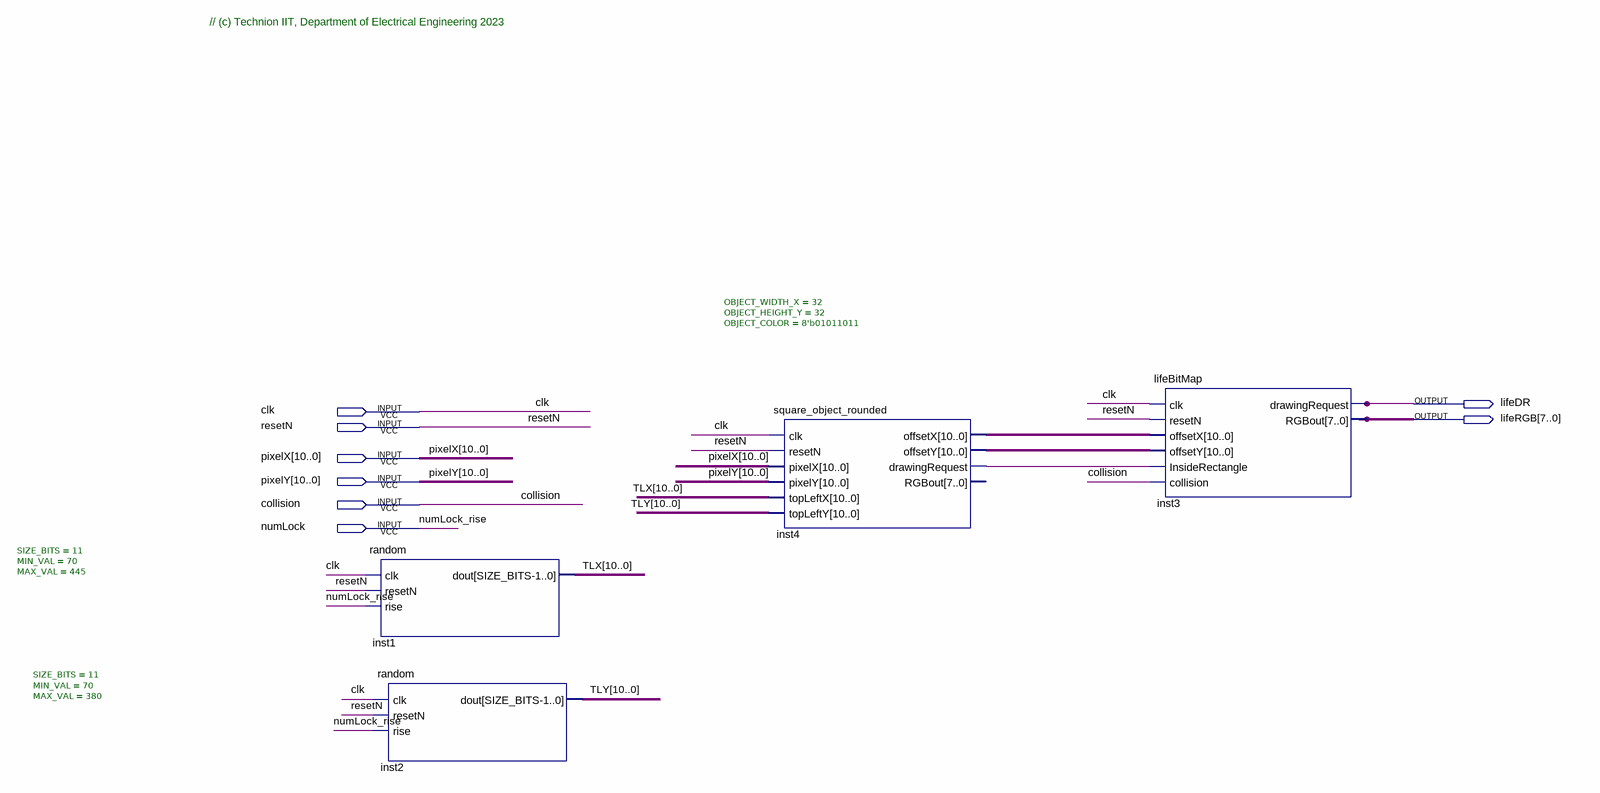
[diagram p0: schematic sheet]
// Quartus schematic Life_Block_T.bdf as structural Verilog: 4 symbols, 8 pins
module Life_Block_T (
  input  clk,
  input  resetN,
  input  [10:0] pixelX,
  input  [10:0] pixelY,
  input  collision,
  input  numLock,
  output lifeDR,
  output [7:0] lifeRGB
);

  wire inst4_drawingrequest;
  wire [10:0] inst4_offsetx, inst4_offsety, TLX, TLY;

  random #(.SIZE_BITS(11), .MIN_VAL(70), .MAX_VAL(445)) inst1 (.clk(clk), .resetN(resetN), .rise(numLock), .dout(TLX));
  random #(.SIZE_BITS(11), .MIN_VAL(70), .MAX_VAL(380)) inst2 (.clk(clk), .resetN(resetN), .rise(numLock), .dout(TLY));
  square_object_rounded #(.OBJECT_WIDTH_X(32), .OBJECT_HEIGHT_Y(32), .OBJECT_COLOR(8'b01011011)) inst4 (
    .clk(clk), .resetN(resetN), .pixelX(pixelX), .pixelY(pixelY), .topLeftX(TLX), .topLeftY(TLY),
    .offsetX(inst4_offsetx), .offsetY(inst4_offsety), .drawingRequest(inst4_drawingrequest));  // open: RGBout
  lifeBitMap inst3 (
    .clk(clk), .resetN(resetN), .offsetX(inst4_offsetx), .offsetY(inst4_offsety),
    .InsideRectangle(inst4_drawingrequest), .collision(collision), .drawingRequest(lifeDR), .RGBout(lifeRGB));

  // Other names for the same wires on the sheet: numLock_rise = numLock

  // Notes on the sheet:
  //   // (c) Technion IIT, Department of Electrical Engineering 2023
endmodule
